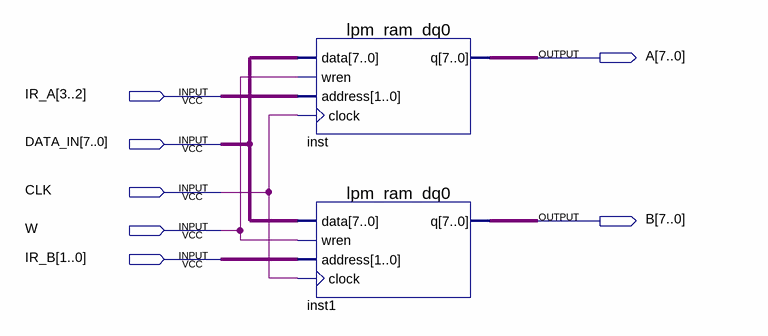
[diagram p0: schematic sheet]
// Quartus schematic REG.bdf as structural Verilog: 2 symbols, 7 pins
module REG (
  input  [3:2] IR_A,
  input  [7:0] DATA_IN,
  input  CLK,
  input  W,
  input  [1:0] IR_B,
  output [7:0] A,
  output [7:0] B
);

  lpm_ram_dq0 inst (.data(DATA_IN), .wren(W), .address(IR_A), .clock(CLK), .q(A));
  lpm_ram_dq0 inst1 (.data(DATA_IN), .wren(W), .address(IR_B), .clock(CLK), .q(B));
endmodule
